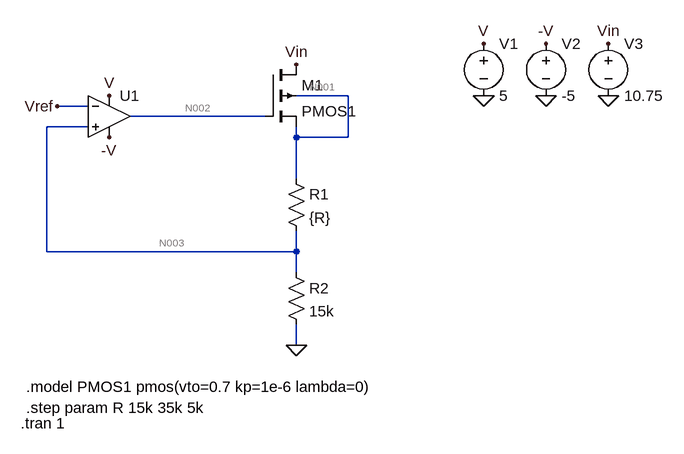
[diagram p0: schematic Draft6.asc]
Draft6.asc, the LTspice schematic file:
Version 4.1
SHEET 1 880 680
WIRE 320 128 240 128
WIRE -80 144 -128 144
WIRE 192 160 -16 160
WIRE -80 176 -144 176
WIRE 240 192 240 176
WIRE 320 192 320 128
WIRE 320 192 240 192
WIRE 240 256 240 192
WIRE -144 368 -144 176
WIRE 240 368 240 336
WIRE 240 368 -144 368
WIRE 240 400 240 368
WIRE 240 512 240 480
FLAG 240 80 Vin
FLAG -128 144 Vref
FLAG 240 512 0
FLAG -48 128 V
FLAG -48 192 -V
FLAG 720 128 0
FLAG 624 128 0
FLAG 528 128 0
FLAG 528 48 V
FLAG 624 48 -V
FLAG 720 48 Vin
SYMBOL pmos4 192 80 R0
SYMATTR InstName M1
SYMATTR Value PMOS1
SYMATTR Value2 l=1u w=10u
SYMBOL OpAmps\\UniversalOpAmp2 -48 160 R0
SYMATTR InstName U1
SYMBOL res 224 240 R0
SYMATTR InstName R1
SYMATTR Value {R}
SYMBOL res 224 384 R0
SYMATTR InstName R2
SYMATTR Value 15k
SYMBOL voltage 528 32 R0
SYMATTR InstName V1
SYMATTR Value 5
SYMBOL voltage 624 32 R0
SYMATTR InstName V2
SYMATTR Value -5
SYMBOL voltage 720 32 R0
SYMATTR InstName V3
SYMATTR Value 10.75
TEXT -176 576 Left 2 !.model PMOS1 pmos(vto=0.7 kp=1e-6 lambda=0)
TEXT -176 608 Left 2 !.step param R 15k 35k 5k
TEXT -184 632 Left 2 !.tran 1

The netlist it stands for:
* Draft6.asc
M1 Vin N002 N001 N001 PMOS1 l=1u w=10u
X§U1 N003 Vref V -V N002 level2 Avol=1Meg GBW=10Meg Slew=10Meg Ilimit=25m Rail=0 Vos=0 En=0 Enk=0 In=0 Ink=0 Rin=500Meg  ; pins In+ In- V+ V- OUT
R1 N001 N003 {R}
R2 N003 0 15k
V1 V 0 5
V2 -V 0 -5
V3 Vin 0 10.75
.model NMOS NMOS
.model PMOS PMOS
.lib standard.mos
.model PMOS1 pmos(vto=0.7 kp=1e-6 lambda=0)
.step param R 15k 35k 5k
.tran 1
.lib UniversalOpAmp2.lib
.backanno
.end

* Results of the author's LTspice run, read from the files saved beside the schematic
* Operating Point (first step), zero values left out:
*   V(n002) = 5 V
*   V(n003) = 5.063 V
*   V(-v) = -5 V
*   V(vin) = 10.75 V
*   V(n001) = 10.13 V
*   V(v) = 5 V
*   Id(M1) = 337.5 µA
*   Is(M1) = -38.3 µA
*   Ib(M1) = -299.2 µA
*   I(V1) = -978 nA
*   I(V3) = -337.5 µA
*   I(R2) = 337.5 µA
*   I(R1) = 337.5 µA
*   I(V2) = 1.163 µA
*   Ix(u1:1) = 10.13 nA
*   Ix(u1:3) = 978 nA
*   Ix(u1:4) = -1.163 µA
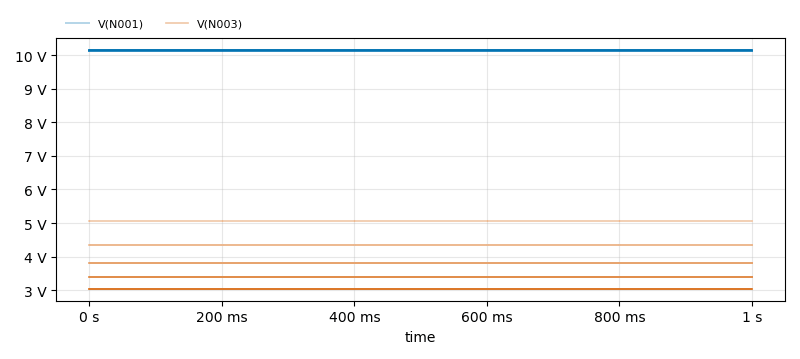
[diagram p1: Transient Analysis of Draft6.asc, plotted from the saved traces]
* Transient Analysis, 5 runs:
*   V(N001) [r=15000]: min 10.13 V, max 10.13 V, average 10.13 V, rms 10.13 V, last 10.13 V
*   V(N001) [r=20000]: min 10.13 V, max 10.13 V, average 10.13 V, rms 10.13 V, last 10.13 V
*   V(N001) [r=25000]: min 10.13 V, max 10.13 V, average 10.13 V, rms 10.13 V, last 10.13 V
*   V(N001) [r=30000]: min 10.14 V, max 10.14 V, average 10.14 V, rms 10.14 V, last 10.14 V
*   V(N001) [r=35000]: min 10.14 V, max 10.14 V, average 10.14 V, rms 10.14 V, last 10.14 V
*   V(N003) [r=15000]: min 5.063 V, max 5.063 V, average 5.063 V, rms 5.063 V, last 5.063 V
*   V(N003) [r=20000]: min 4.342 V, max 4.342 V, average 4.342 V, rms 4.342 V, last 4.342 V
*   V(N003) [r=25000]: min 3.8 V, max 3.8 V, average 3.8 V, rms 3.8 V, last 3.8 V
*   V(N003) [r=30000]: min 3.379 V, max 3.379 V, average 3.379 V, rms 3.379 V, last 3.379 V
*   V(N003) [r=35000]: min 3.042 V, max 3.042 V, average 3.042 V, rms 3.042 V, last 3.042 V